# Altium schematic sheet DigitalPotentiometers.SchDoc
size 420 x 297 mm; DocumentNumber: Audio output
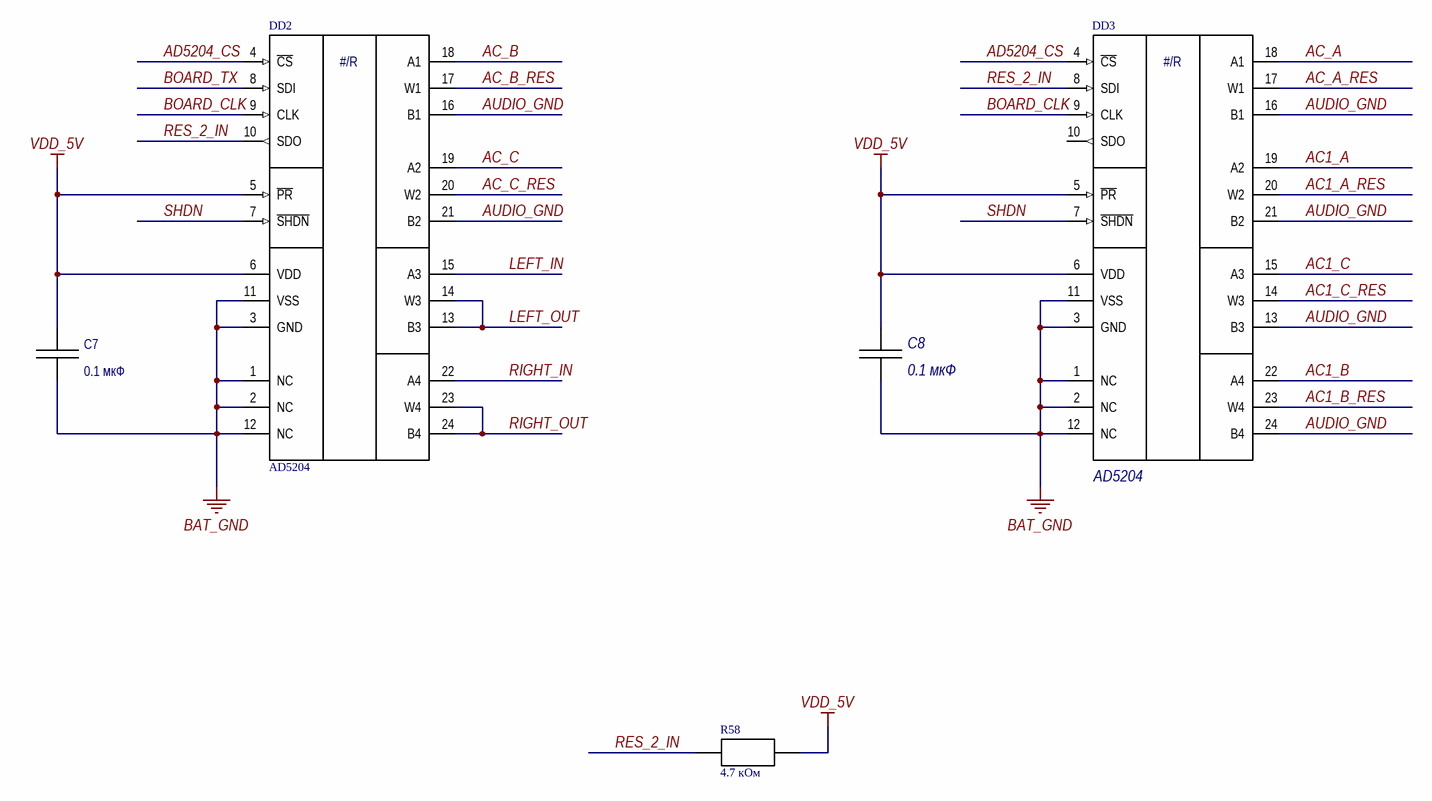
[diagram p0: DigitalPotentiometers.SchDoc]

## Parts
C7  0.1 мкФ  [C 1206]
C8  0.1 мкФ  [C 1206]
DD2  AD5204  [TSSOP-24]
DD3  AD5204  [TSSOP-24]
R58  4.7 кОм  [RES 0805]

## Nets
BAT_GND: C7.2 C8.2 DD2.1(NC) DD2.2(NC) DD2.3(GND) DD2.11(VSS) DD2.12(NC) DD3.1(NC) DD3.2(NC) DD3.3(GND) DD3.11(VSS) DD3.12(NC)
VDD_5V: C7.1 C8.1 DD2.5(~{PR}) DD2.6(VDD) DD3.5(~{PR}) DD3.6(VDD) R58.2
AC1_A: DD3.19(A2)
AC1_A_RES: DD3.20(W2)
AC1_B: DD3.22(A4)
AC1_B_RES: DD3.23(W4)
AC1_C: DD3.15(A3)
AC1_C_RES: DD3.14(W3)
AC_A: DD3.18(A1)
AC_A_RES: DD3.17(W1)
AC_B: DD2.18(A1)
AC_B_RES: DD2.17(W1)
AC_C: DD2.19(A2)
AC_C_RES: DD2.20(W2)
AD5204_CS: DD2.4(~{CS}) DD3.4(~{CS})
AUDIO_GND: DD2.16(B1) DD2.21(B2) DD3.13(B3) DD3.16(B1) DD3.21(B2) DD3.24(B4)
BOARD_CLK: DD2.9(CLK) DD3.9(CLK)
BOARD_TX: DD2.8(SDI)
LEFT_IN: DD2.15(A3)
LEFT_OUT: DD2.13(B3) DD2.14(W3)
RES_2_IN: DD2.10(SDO) DD3.8(SDI) R58.1
RIGHT_IN: DD2.22(A4)
RIGHT_OUT: DD2.23(W4) DD2.24(B4)
SHDN: DD2.7(~{SHDN}) DD3.7(~{SHDN})

Not connected (* = marked no-connect by the designer): DD3 10(SDO)

## Notes on the sheet
- Подп. и дата
- Инв. № дубл.
- Взам. инв. №
- Инв. № подл.
- Лист
- Изм.
- № докум.
- Подп.
- Дата
- Копировал
- Формат А3
- (in symbol AD5204) #/R

## Library data of the parts
C7 C8 = CAP 1206: SMD Capacitor 1206; Manufacturer: /Укажите компанию-производителя/; Tolerance: /Укажите допуск в процентах/; Temperature coefficient: /Формат: ±? ppm/°C/; Type: Конденсатор керамический; TC: /Укажите тип диэлектрика/; Size: 1206; Temperature range: /Формат: -? ... ? °C/; Value: 0.1 мкФ
R58 = RES 0805